# Altium schematic sheet aux_powers.SchDoc
size A4
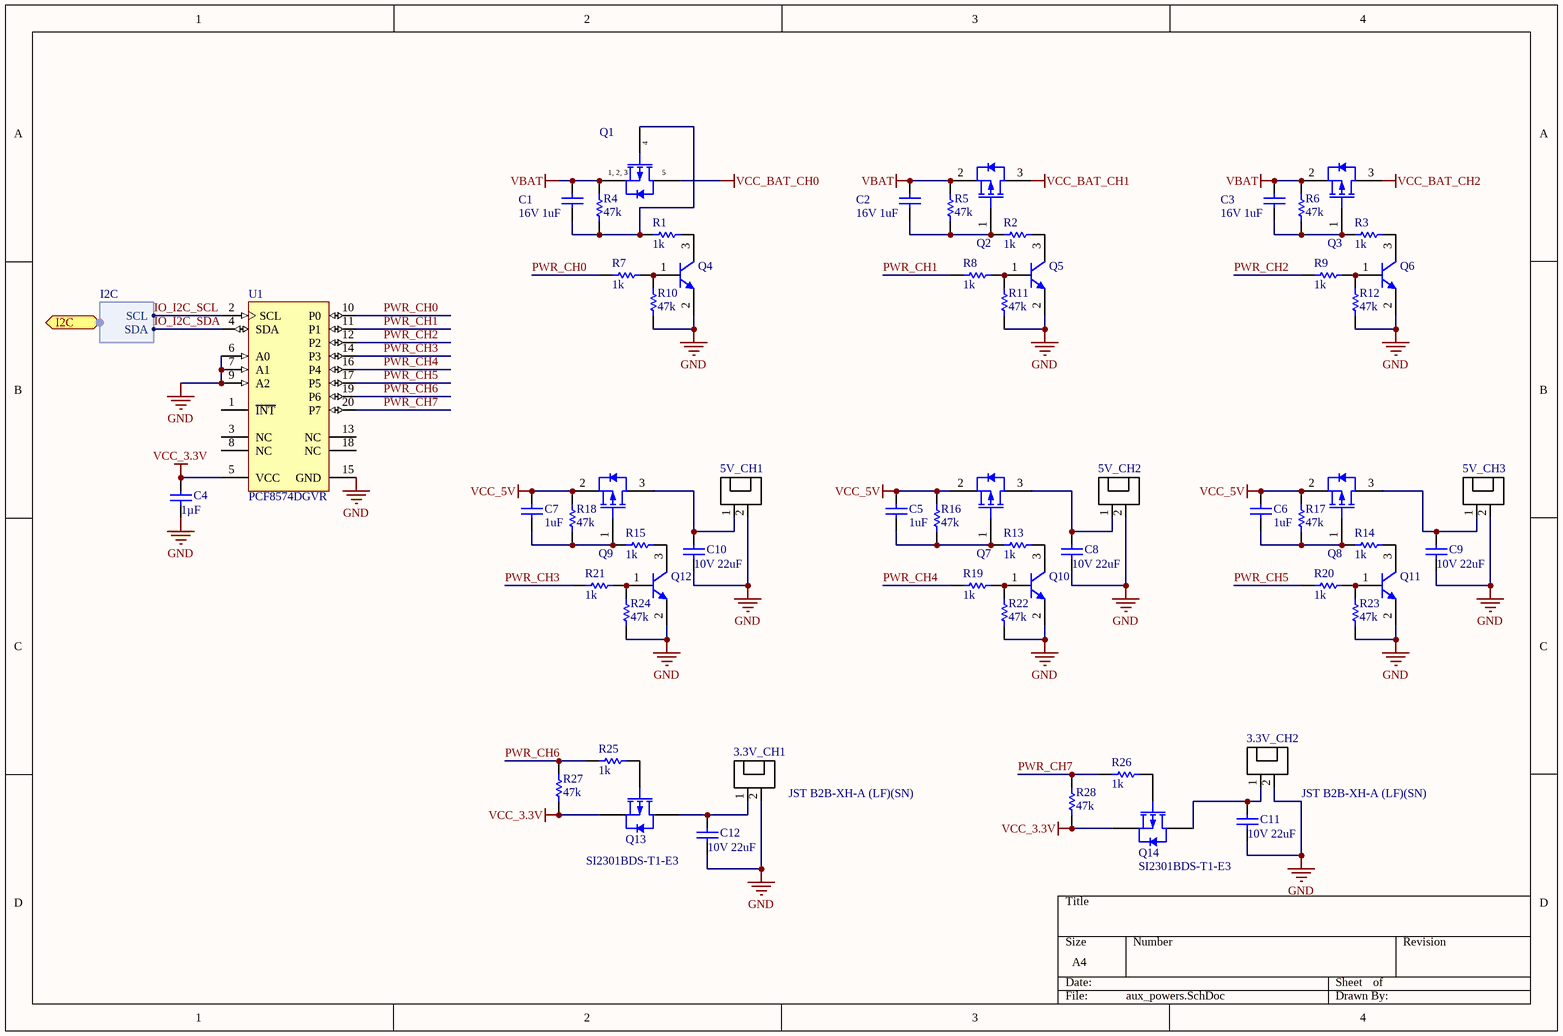
[diagram p0: aux_powers.SchDoc]

## Parts
3.3V_CH1  JST B2B-XH-A (LF)(SN)  [PCB-s8s8ac3ylnu6waak0fxh-1]
3.3V_CH2  JST B2B-XH-A (LF)(SN)  [PCB-s8s8ac3ylnu6waak0fxh-1]
5V_CH1  JST B2B-XH-A (LF)(SN)  [PCB-s8s8ac3ylnu6waak0fxh-1]  (value not drawn)
5V_CH2  JST B2B-XH-A (LF)(SN)  [PCB-s8s8ac3ylnu6waak0fxh-1]  (value not drawn)
5V_CH3  JST B2B-XH-A (LF)(SN)  [PCB-s8s8ac3ylnu6waak0fxh-1]  (value not drawn)
C1  16V 1uF  [CAPC1005X56X25NL10T15]
C2  16V 1uF  [CAPC1005X56X25NL10T15]
C3  16V 1uF  [CAPC1005X56X25NL10T15]
C4  1µF  [CAPC1608X90X35LL15T15]
C5  1uF  [CAPC1005X56X25NL10T15]
C6  1uF  [CAPC1005X56X25NL10T15]
C7  1uF  [CAPC1005X56X25NL10T15]
C8  10V 22uF  [PCB-l6gghpm6qgmuzlt59psh-1]
C9  10V 22uF  [PCB-l6gghpm6qgmuzlt59psh-1]
C10  10V 22uF  [PCB-l6gghpm6qgmuzlt59psh-1]
C11  10V 22uF  [PCB-l6gghpm6qgmuzlt59psh-1]
C12  10V 22uF  [PCB-l6gghpm6qgmuzlt59psh-1]
Q1  Vishay SI7149ADP-T1-GE3  [PCB-zhz9tig7820limf6j70v-1]  (value not drawn)
Q2  Vishay SISS23DN-T1-GE3  [PCB-3102182-1]  (value not drawn)
Q3  Vishay SISS23DN-T1-GE3  [PCB-3102182-1]  (value not drawn)
Q4  SMMBT4401LT1G  [ONSC-SOT-23-3-318-08_V]  (value not drawn)
Q5  SMMBT4401LT1G  [ONSC-SOT-23-3-318-08_V]  (value not drawn)
Q6  SMMBT4401LT1G  [ONSC-SOT-23-3-318-08_V]  (value not drawn)
Q7  Vishay SISS23DN-T1-GE3  [PCB-3102182-1]  (value not drawn)
Q8  Vishay SISS23DN-T1-GE3  [PCB-3102182-1]  (value not drawn)
Q9  Vishay SISS23DN-T1-GE3  [PCB-3102182-1]  (value not drawn)
Q10  SMMBT4401LT1G  [ONSC-SOT-23-3-318-08_V]  (value not drawn)
Q11  SMMBT4401LT1G  [ONSC-SOT-23-3-318-08_V]  (value not drawn)
Q12  SMMBT4401LT1G  [ONSC-SOT-23-3-318-08_V]  (value not drawn)
Q13  SI2301BDS-T1-E3  [SOT-23-TT3_L]
Q14  SI2301BDS-T1-E3  [SOT-23-TT3_L]
R1  1k  [PCB-imsgvtunp3nvnj2wzwbs-1]
R2  1k  [PCB-imsgvtunp3nvnj2wzwbs-1]
R3  1k  [PCB-imsgvtunp3nvnj2wzwbs-1]
R4  47k  [RESC1005X40X25LL05T10]
R5  47k  [RESC1005X40X25LL05T10]
R6  47k  [RESC1005X40X25LL05T10]
R7  1k  [PCB-imsgvtunp3nvnj2wzwbs-1]
R8  1k  [PCB-imsgvtunp3nvnj2wzwbs-1]
R9  1k  [PCB-imsgvtunp3nvnj2wzwbs-1]
R10  47k  [RESC1005X40X25LL05T10]
R11  47k  [RESC1005X40X25LL05T10]
R12  47k  [RESC1005X40X25LL05T10]
R13  1k  [PCB-imsgvtunp3nvnj2wzwbs-1]
R14  1k  [PCB-imsgvtunp3nvnj2wzwbs-1]
R15  1k  [PCB-imsgvtunp3nvnj2wzwbs-1]
R16  47k  [RESC1005X40X25LL05T10]
R17  47k  [RESC1005X40X25LL05T10]
R18  47k  [RESC1005X40X25LL05T10]
R19  1k  [PCB-imsgvtunp3nvnj2wzwbs-1]
R20  1k  [PCB-imsgvtunp3nvnj2wzwbs-1]
R21  1k  [PCB-imsgvtunp3nvnj2wzwbs-1]
R22  47k  [RESC1005X40X25LL05T10]
R23  47k  [RESC1005X40X25LL05T10]
R24  47k  [RESC1005X40X25LL05T10]
R25  1k  [PCB-imsgvtunp3nvnj2wzwbs-1]
R26  1k  [PCB-imsgvtunp3nvnj2wzwbs-1]
R27  47k  [RESC1005X40X25LL05T10]
R28  47k  [RESC1005X40X25LL05T10]
U1  PCF8574DGVR  [DGV20_L]

## Ports
I2C (harness I2C)

## Harnesses
I2C: SCL, SDA

## Nets
GND: 3.3V_CH1.2 3.3V_CH2.2 5V_CH1.2 5V_CH2.2 5V_CH3.2 C4.2 C8.1 C9.1 C10.1 C11.1 C12.1 Q4.2(E) Q5.2(E) Q6.2(E) Q10.2(E) Q11.2(E) Q12.2(E) R10.1 R11.1 R12.1 R22.1 R23.1 R24.1 U1.6(A0) U1.7(A1) U1.9(A2) U1.15(GND)
VBAT: C1.2 C2.2 C3.2 Q1.S Q2.2(D) Q3.2(D) R4.2 R5.2 R6.2
VCC_3.3V: C4.1 Q13.2 Q14.2 R27.1 R28.1 U1.5(VCC)
VCC_5V: C5.2 C6.2 C7.2 Q7.2(D) Q8.2(D) Q9.2(D) R16.2 R17.2 R18.2
VCC_BAT_CH0: Q1.D
VCC_BAT_CH1: Q2.3(S)
VCC_BAT_CH2: Q3.3(S)
IO_I2C_SCL: U1.2(SCL) ; port I2C.SCL
IO_I2C_SDA: U1.4(SDA) ; port I2C.SDA
PWR_CH0: R7.1 U1.10(P0)
PWR_CH1: R8.1 U1.11(P1)
PWR_CH2: R9.1 U1.12(P2)
PWR_CH3: R21.1 U1.14(P3)
PWR_CH4: R19.1 U1.16(P4)
PWR_CH5: R20.1 U1.17(P5)
PWR_CH6: R25.1 R27.2 U1.19(P6)
PWR_CH7: R26.1 R28.2 U1.20(P7)
Net3.3V_CH1_1: 3.3V_CH1.1 C12.2 Q13.3
Net3.3V_CH2_1: 3.3V_CH2.1 C11.2 Q14.3
Net5V_CH1_1: 5V_CH1.1 C10.2 Q9.3(S)
Net5V_CH2_1: 5V_CH2.1 C8.2 Q7.3(S)
Net5V_CH3_1: 5V_CH3.1 C9.2 Q8.3(S)
NetC1_1: C1.1 Q1.G R1.2 R4.1
NetC2_1: C2.1 Q2.1(G) R2.2 R5.1
NetC3_1: C3.1 Q3.1(G) R3.2 R6.1
NetC5_1: C5.1 Q7.1(G) R13.2 R16.1
NetC6_1: C6.1 Q8.1(G) R14.2 R17.1
NetC7_1: C7.1 Q9.1(G) R15.2 R18.1
NetQ4_1: Q4.1(B) R7.2 R10.2
NetQ4_3: Q4.3(C) R1.1
NetQ5_1: Q5.1(B) R8.2 R11.2
NetQ5_3: Q5.3(C) R2.1
NetQ6_1: Q6.1(B) R9.2 R12.2
NetQ6_3: Q6.3(C) R3.1
NetQ10_1: Q10.1(B) R19.2 R22.2
NetQ10_3: Q10.3(C) R13.1
NetQ11_1: Q11.1(B) R20.2 R23.2
NetQ11_3: Q11.3(C) R14.1
NetQ12_1: Q12.1(B) R21.2 R24.2
NetQ12_3: Q12.3(C) R15.1
NetQ13_1: Q13.1 R25.2
NetQ14_1: Q14.1 R26.2

Not connected (* = marked no-connect by the designer): U1 1(~{INT}) 3(NC) 8(NC) 13(NC) 18(NC)

## Notes on the sheet
- (in symbol CMP-ebab2065408c346c-3) 4; 1, 2, 3; 5

## Library data of the parts
3.3V_CH1 3.3V_CH2 5V_CH1-5V_CH3 = CMP-a2a66bdac84f7d61-16: XH Series 2 Position 2.5 mm Pitch Through Hole Top Entry Shrouded Header; Gender: Male; Voltage Rating (AC): 250 V; Lead-Free Status: Lead Free; Insulation Resistance: 1.00 GΩ; Number of Contacts: 2; Contact Resistance: 10.0 mΩ; Current Rating: 3.00 A; Mounting Style: Through Hole, Vertical; RoHS: Compliant; Manufacturer Part Number: B2B-XH-A (LF)(SN); Octopart URL: http://octopart.com/b2b-xh-a+%28lf%29%28sn%29-jst-7753615; Contact Material: Brass; REACH SVHC Compliance: No SVHC; OctopartID: a2a66bdac84f7d61; Contact Plating: Tin
C1-C3 C5-C7 = CMP-126963-2: Cap Ceramic 1uF 10V X5R 20% SMD 0402 85C Paper T/R; Manufacturer Part Number: 0402ZD105MAT2A; Capacitance: 1e-06 F; Lead-Free Status: Lead Free; Voltage Rating (DC): 10.0 V; Capacitance Tolerance: ±20%; Case/Package: 0402; Dielectric Characteristic: X5R; Mounting Style: Surface Mount; Number of Pins: 2; Octopart Url: https://octopart.com/0402zd105mat2a-avx+interconnect+%2F+elco-7158066; OctopartID: dd611406c13502a6; Packaging: Cut Tape (CT); REACH SVHC Compliance: No SVHC; RoHS: Compliant
C4 = CMP-f2f83b8d074c2d3f-6: 0603 1 uF 16 V ±10 % Tolerance X5R SMT Multilayer Ceramic Capacitor; Capacitance Tolerance: ±10%; Lead-Free Status: Lead Free; Voltage Rating (DC): 16.0 V; Dielectric Characteristic: X5R; Mounting Style: Surface Mount; OctopartID: f2f83b8d074c2d3f
C8-C12 = CMP-1dc8d7348becc20f-1: Cap Ceramic 22uF 10V X5R 10% Pad SMD 1206 85C Automotive T/R; Manufacturer Part Number: LMK316ABJ226KLHT; Octopart URL: https://octopart.com/lmk316abj226klht-taiyo+yuden-66499394; Case/Package: 1206; Mounting Style: Surface Mount
Q1 = CMP-ebab2065408c346c-3: Si7149ADP Series 30 V 50 A 50 mOhm Surface Mount P-Channel Mosfet-PowerPAK SO-8
Q2 Q3 Q7-Q9 = CMP-74eabf6acbf3ab2d-1: Si7617DN Series 30 V 12.3 mOhm 3.7 W P-Channel Mosfet - POWERPAK-1212-8; RoHS: Compliant
Q4-Q6 Q10-Q12 = CMP-860861-2: Switching Transistor, NPN Silicon, 3-Pin SOT-23, Pb-Free, Tape and Reel; Lead-Free Status: Lead Free; Lifecycle Status: Active; Octopart Url: https://octopart.com/smmbt4401lt1g-on+semiconductor-17512939; OctopartID: 7accb2cd6641a50b; RoHS: Compliant; Manufacturer Part Number: SMMBT4401LT1G
Q13 Q14 = CMP-a5cd6e462d967a0a-6: Mosfet, P-ch, Vdss -20V, Rds(on) 0.08 Ohm, Id -2.2A, TO-236 (SOT-23), Pd 0.7W, Vgs +/-8V; Power Dissipation: 900 mW; Continuous Drain Current (Ids): -2.20 A; Drain to Source Voltage (Vds): -20.0 V; Drain to Source Resistance (on) (Rds): 100 mΩ; Number of Pins: 3; Packaging: Cut Tape (CT); REACH SVHC Compliance: No SVHC; OctopartID: a5cd6e462d967a0a; Mounting Style: Surface Mount; Octopart URL: https://octopart.com/si2301bds-t1-e3-vishay-42052925; RoHS: Compliant
R1-R3 R7-R9 R13-R15 R19-R21 R25 R26 = CMP-56d29ab4a6068915-1: Res Thick Film 0402 1K Ohm 1% 0.125W(1/8W) ±100ppm/C Pad SMD T/R; Manufacturer Part Number: CRGP0402F1K0; Resistance Tolerance: ±1%
R4-R6 R10-R12 R16-R18 R22-R24 R27 R28 = CMP-1859043-2: Thick Film Resistors - SMD 1/8watt 47Kohms 1% 100ppm High Power; Manufacturer Part Number: CRCW040247K0FKEDHP; Lead-Free Status: Lead Free; Power Rating: 0.063 W; Resistance: 47000.0 Ω; Case/Package: 0402; Octopart Url: https://octopart.com/crcw040247k0fkedhp-vishay+dale-44383189; OctopartID: 3aaef101241de569; Resistance Tolerance: ±1%; RoHS: Compliant
U1 = CMP-4873507-2: Remote 8-Bit I/O Expander for I2C-Bus, 2.5 to 6 V, -40 to 85 degC, 20-pin TVSOP (DGV), Green (RoHS & no Sb/Br); Lead-Free Status: Lead Free; Number of Outputs: 8; Manufacturer Part Number: PCF8574DGVR; Case/Package: TVSOP; Lifecycle Status: Active; Mounting Style: Surface Mount; Octopart Url: https://octopart.com/pcf8574dgvr-texas+instruments-469516; OctopartID: b39b7a96bcf16c5c; Packaging: Reel; RoHS: Compliant